# Altium schematic sheet Inputs.SchDoc
size A4; SheetNumber: 2; SheetTotal: 2
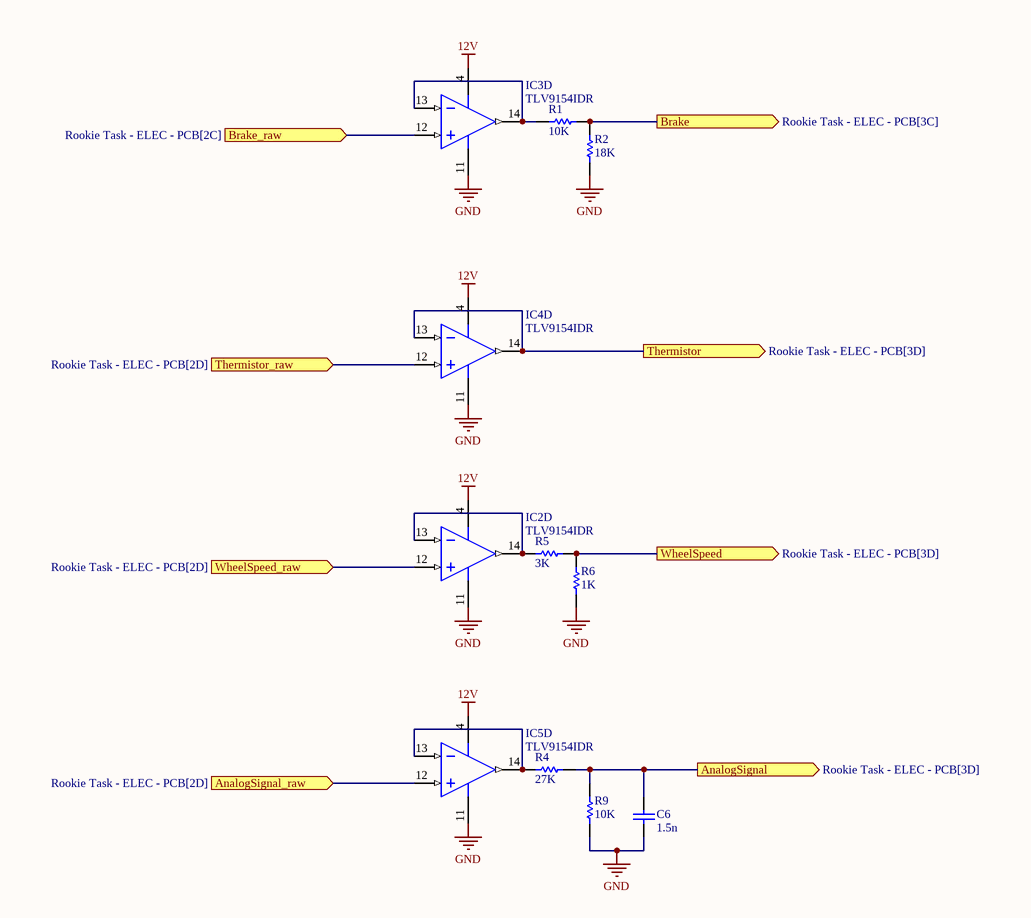
[diagram p0: Inputs.SchDoc]

## Parts
C6  value 1.5n  (hidden comment: Capacitor)
IC2  TLV9154IDR  [SOIC127P600X175-14N]  (part D of 4)
IC3  TLV9154IDR  [SOIC127P600X175-14N]  (part D of 4)
IC4  TLV9154IDR  [SOIC127P600X175-14N]  (part D of 4)
IC5  TLV9154IDR  [SOIC127P600X175-14N]  (part D of 4)
R1  value 10K  (hidden comment: Resistor)
R2  value 18K  (hidden comment: Resistor)
R4  value 27K  (hidden comment: Resistor)
R5  value 3K  (hidden comment: Resistor)
R6  value 1K  (hidden comment: Resistor)
R9  value 10K  (hidden comment: Resistor)

## Ports
AnalogSignal (out, see Rookie Task - ELEC - PCB[3D]), AnalogSignal_raw (in, see Rookie Task - ELEC - PCB[2D]), Brake (out, see Rookie Task - ELEC - PCB[3C]), Brake_raw (in, see Rookie Task - ELEC - PCB[2C]), Thermistor (out, see Rookie Task - ELEC - PCB[3D]), Thermistor_raw (in, see Rookie Task - ELEC - PCB[2D]), WheelSpeed (out, see Rookie Task - ELEC - PCB[3D]), WheelSpeed_raw (in, see Rookie Task - ELEC - PCB[2D])

## Nets
12V: IC2.4(VDD) IC3.4(VDD) IC4.4(VDD) IC5.4(VDD)
GND: C6.1 IC2.11(VSS) IC3.11(VSS) IC4.11(VSS) IC5.11(VSS) R2.1 R6.1 R9.1
AnalogSignal: C6.2 R4.2 R9.2 ; port AnalogSignal
AnalogSignal_raw: IC5.12(VIND+) ; port AnalogSignal_raw
Brake: R1.2 R2.2 ; port Brake
Brake_raw: IC3.12(VIND+) ; port Brake_raw
Thermistor: IC4.13(VIND-) IC4.14(VOUTD) ; port Thermistor
Thermistor_raw: IC4.12(VIND+) ; port Thermistor_raw
WheelSpeed: R5.2 R6.2 ; port WheelSpeed
WheelSpeed_raw: IC2.12(VIND+) ; port WheelSpeed_raw
NetIC2_13: IC2.13(VIND-) IC2.14(VOUTD) R5.1
NetIC3_13: IC3.13(VIND-) IC3.14(VOUTD) R1.1
NetIC5_13: IC5.13(VIND-) IC5.14(VOUTD) R4.1

## Library data of the parts
C6 = Capacitor: SimulationGenericComponent: True
IC2-IC5 = CMP-014-00001-2: Texas Instruments 16-V; Datasheet Link: https://www.ti.com/lit/gpn/tlv9154; Design Item ID: TLV9154IDR; Manufacturer_Name: Texas Instruments; Arrow Part Number: TLV9154IDR; Mouser Part Number: 595-TLV9154IDR; Manufacturer_Part_Number: TLV9154IDR; Mouser Price/Stock: https://www.mouser.co.uk/ProductDetail/Texas-Instruments/TLV9154IDR?qs=eP2BKZSCXI75RZFJCFYjnQ%3D%3D; Arrow Price/Stock: https://www.arrow.com/en/products/tlv9154idr/texas-instruments?utm_currency=USD&region=europe; Source: Schlib2.SchLib; Height: 1.75mm
R1 R2 R4-R6 R9 = Resistor: TC1: 0; SimulationGenericComponent: True; TC2: 0